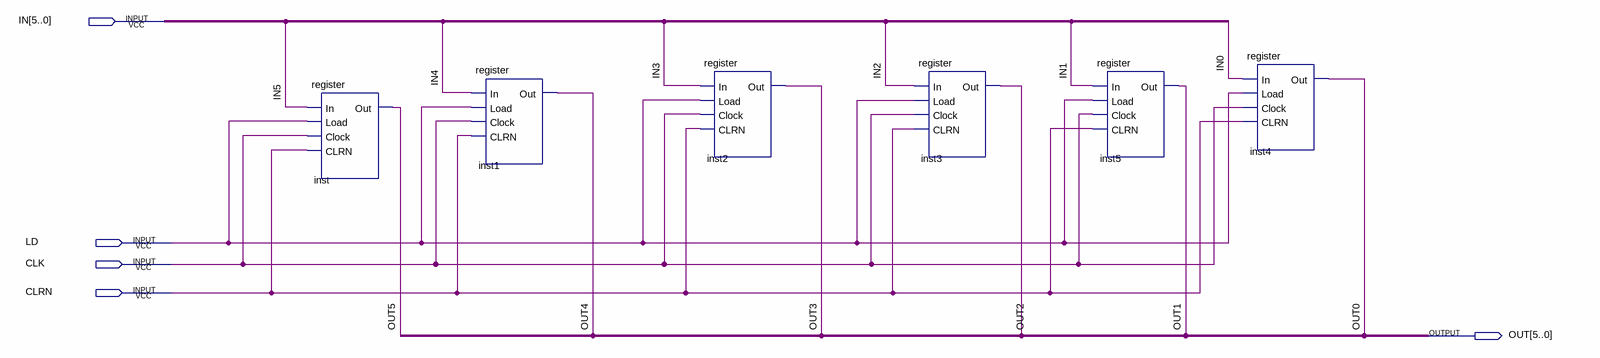
[diagram p0: schematic sheet]
// Quartus schematic reg4b.bdf as structural Verilog: 6 symbols, 5 pins
module reg4b (
  input  [5:0] IN,
  input  LD,
  input  CLK,
  input  CLRN,
  output [5:0] OUT
);

  register inst (.In(IN[5]), .Load(LD), .Clock(CLK), .CLRN(CLRN), .Out(OUT[5]));
  register inst1 (.In(IN[4]), .Load(LD), .Clock(CLK), .CLRN(CLRN), .Out(OUT[4]));
  register inst2 (.In(IN[3]), .Load(LD), .Clock(CLK), .CLRN(CLRN), .Out(OUT[3]));
  register inst3 (.In(IN[2]), .Load(LD), .Clock(CLK), .CLRN(CLRN), .Out(OUT[2]));
  register inst5 (.In(IN[1]), .Load(LD), .Clock(CLK), .CLRN(CLRN), .Out(OUT[1]));
  register inst4 (.In(IN[0]), .Load(LD), .Clock(CLK), .CLRN(CLRN), .Out(OUT[0]));
endmodule
